# Altium schematic sheet Motor-Y.SchDoc: Motor-Y
size Letter; DocumentNumber: 3; SheetNumber: 6; SheetTotal: 11
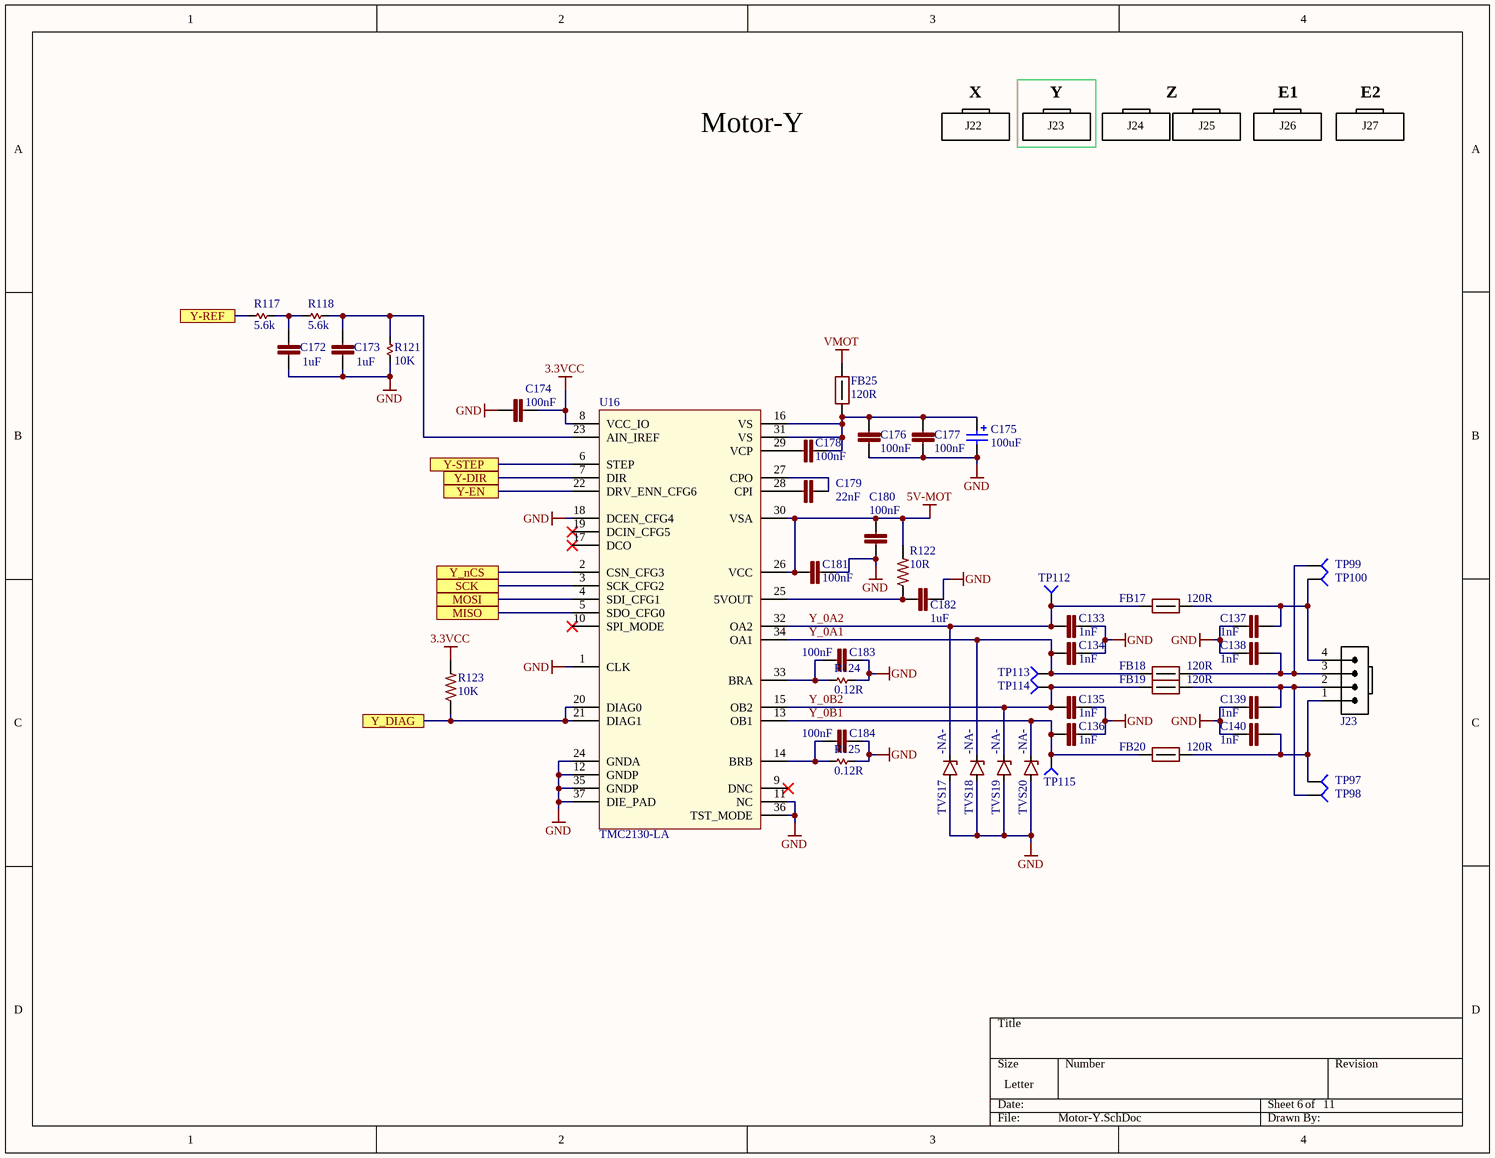
[diagram p0: Motor-Y.SchDoc]

## Parts
C133  1nF  [C0402]
C134  1nF  [C0402]
C135  1nF  [C0402]
C136  1nF  [C0402]
C137  1nF  [C0402]
C138  1nF  [C0402]
C139  1nF  [C0402]
C140  1nF  [C0402]
C172  1uF  [C0402]
C173  1uF  [C0402]
C174  100nF  [C0402]
C175  value 100uF  [CAP-ELEC-063063077]  (hidden comment: UWT1V101MCL1GS)
C176  100nF  [C0603]
C177  100nF  [C0603]
C178  100nF  [C0603]
C179  22nF  [C0402]
C180  100nF  [C0402]
C181  100nF  [C0402]
C182  1uF  [C0402]
C183  100nF  [C0603]
C184  100nF  [C0603]
FB17  120R  [FB0603]
FB18  120R  [FB0603]
FB19  120R  [FB0603]
FB20  120R  [FB0603]
FB25  120R  [FB0603]
J23  Molex 0705430038  [4POL254 PIN-IN-PASTE]  (value not drawn)
R117  5.6k  [R0402]
R118  5.6k  [R0402]
R121  10K  [R0402]
R122  10R  [R0402]
R123  10K  [R0402]
R124  0.12R  [R1206]
R125  0.12R  [R1206]
TP97  TP4  [TP-2]  (value not drawn)  (no BOM)
TP98  TP4  [TP-2]  (value not drawn)  (no BOM)
TP99  TP4  [TP-2]  (value not drawn)  (no BOM)
TP100  TP4  [TP-2]  (value not drawn)  (no BOM)
TP112  TP4  [TP-2]  (value not drawn)  (no BOM)
TP113  TP4  [TP-2]  (value not drawn)  (no BOM)
TP114  TP4  [TP-2]  (value not drawn)  (no BOM)
TP115  TP4  [TP-2]  (value not drawn)  (no BOM)
TVS17  value -NA-  [SMF]  (hidden comment: TVS 30V SMF)
TVS18  value -NA-  [SMF]  (hidden comment: TVS 30V SMF)
TVS19  value -NA-  [SMF]  (hidden comment: TVS 30V SMF)
TVS20  value -NA-  [SMF]  (hidden comment: TVS 30V SMF)
U16  TMC2130-LA  [QFN36-50P500X600X900_HS-37N]

## Ports
MISO, MOSI, SCK, Y-DIR, Y-EN, Y-REF, Y-STEP, Y_DIAG, Y_nCS

## Nets
3.3VCC: C174.1 R123.2 U16.8(VCC_IO)
5V-MOT: C180.2 C181.2 R122.2 U16.26(VCC) U16.30(VSA)
GND: C133.2 C134.2 C135.2 C136.2 C137.2 C138.2 C139.2 C140.2 C172.2 C173.2 C174.2 C175.2 C176.1 C177.1 C180.1 C181.1 C182.2 C183.1 C184.1 R121.1 R124.2 R125.2 TVS17.A TVS18.A TVS19.A TVS20.A U16.1(CLK) U16.11(NC) U16.12(GNDP) U16.18(DCEN_CFG4) U16.24(GNDA) U16.35(GNDP) U16.36(TST_MODE) U16.37(DIE_PAD)
VMOT: FB25.2
MISO: U16.5(SDO_CFG0) ; port MISO
MOSI: U16.4(SDI_CFG1) ; port MOSI
SCK: U16.3(SCK_CFG2) ; port SCK
Y-DIR: U16.7(DIR) ; port Y-DIR
Y-EN: U16.22(DRV_ENN_CFG6) ; port Y-EN
Y-REF: R117.1 ; port Y-REF
Y-STEP: U16.6(STEP) ; port Y-STEP
Y_0A1: C134.1 FB18.1 TP113.1 TVS18.K U16.34(OA1)
Y_0A2: C133.1 FB17.1 TP112.1 TVS17.K U16.32(OA2)
Y_0B1: C136.1 FB20.1 TP115.1 TVS20.K U16.13(OB1)
Y_0B2: C135.1 FB19.1 TP114.1 TVS19.K U16.15(OB2)
Y_DIAG: R123.1 U16.20(DIAG0) U16.21(DIAG1) ; port Y_DIAG
Y_nCS: U16.2(CSN_CFG3) ; port Y_nCS
NetC137_1: C137.1 FB17.2 J23.4 TP100.1
NetC138_1: C138.1 FB18.2 J23.3 TP99.1
NetC139_1: C139.1 FB19.2 J23.2 TP98.1
NetC140_1: C140.1 FB20.2 J23.1 TP97.1
NetC172_1: C172.1 R117.2 R118.1
NetC173_1: C173.1 R118.2 R121.2 U16.23(AIN_IREF)
NetC175_1: C175.1 C176.2 C177.2 C178.2 FB25.1 U16.16(VS) U16.31(VS)
NetC178_1: C178.1 U16.29(VCP)
NetC179_1: C179.1 U16.28(CPI)
NetC179_2: C179.2 U16.27(CPO)
NetC182_1: C182.1 R122.1 U16.25(5VOUT)
NetC183_2: C183.2 R124.1 U16.33(BRA)
NetC184_2: C184.2 R125.1 U16.14(BRB)

Not connected (* = marked no-connect by the designer): U16 9(DNC)* 10(SPI_MODE)* 17(DCO)* 19(DCIN_CFG5)*

## Notes on the sheet
- X
- Y
- Z
- E1
- E2
- Motor-Y
- J22
- J23
- J24
- J25
- J26
- J27

## Library data of the parts
C133-C140 = CAP 1nF 50V 0402 X7R: 1000pF 50V Ceramic Capacitor X7R 0402 (1005 Metric) 0.039" L x 0.020" W (1.00mm x 0.50mm); MANUFACTURER: Murata; MANUFACTURER #: GRM155R71H102KA01D; PART: 1nF 50V X7R 0402; PART DESCRIPTION: 1000pF ±10% 50V Ceramic Capacitor X7R 0402 (1005 Metric); TOLERANCE: 10%; VALUE: 1nF; DISTRIBUTOR #: 490-1303-2-ND; DISTRIBUTOR: Digi-Key Electronics; EE_SPEC: 50V
C172 C173 = GRM155R60J105KE19D: CAP CER 0402 1uF 6.3V 10% X5R; MANUFACTURER: Murata; PART: 1uF 6.3V X5R 0402; PART DESCRIPTION: 1µF ±10% 6.3V Ceramic Capacitor X5R 0402 (1005 Metric); VALUE: 1uF; MANUFACTURER #: GRM155R60J105KE19D; DISTRIBUTOR #: 490-1320-2-ND; DISTRIBUTOR: Digi-Key Electronics; TOLERANCE: 10%; EE_SPEC: 1uF 6.3V X5R 0402
C174 C180 C181 = GRM155R71C104KA88D: CAP CER 0402 100nF 16V 10% X7R; Manufacturer: Murata; PART: 0.1uF 16V X7R 0402; Part Description: 0.10µF ±10% 16V Ceramic Capacitor X7R 0402 (1005 Metric); EE_SPEC: 100nF 16V X7R 0402; VALUE: 100nF; MANUFACTURER #: GRM155R71C104KA88D; DISTRIBUTOR #: 490-3261-2-ND; DISTRIBUTOR: Digi-Key Electronics; Tolerance: 10%
C175 = UWT1V101MCL1GS: CAP ALUM 100UF 35V 20% SMD; Manufacturer: Nichicon; PART: 100uF 35V SMD Al-El; Part Description: 100µF 35V Aluminum Capacitors Radial, Can - SMD 1000 Hrs @ 105°C; EE_SPEC: 100uF 35V Al-El; MANUFACTURER #: UWT1V101MCL1GS; DISTRIBUTOR #: 493-2203-2-ND; DISTRIBUTOR: Digi-Key Electronics; Tolerance: 20%
C176-C178 C183 C184 = C0603C104K5RACTU: CAP CER 0603 100nF 50V 10% X7R; Manufacturer: Kemet; Part Description: 0.1µF ±10% 50V Ceramic Capacitor X7R 0603 (1608 Metric); EE_SPEC: 100nF 50V X7R 0603; VALUE: 100nF; MANUFACTURER #: C0603C104K5RACTU; DISTRIBUTOR #: 399-5089-2-ND; DISTRIBUTOR: Digi-Key Electronics; PART: 100nF 50V X7R 0603; Tolerance: 10%
C179 = GCM155R71H223KA55D: CAP CER 0402 22nF ±10% 50V X7R; Manufacturer: YAGEO; Part Description: 0.022µF ±10% 50V Ceramic Capacitor X7R 0402 (1005 Metric); EE_SPEC: 22nF 50V X7R 0402; Tolerance: +/- 10%; VALUE: 22nF; MANUFACTURER #: GCM155R71H223KA55D; DISTRIBUTOR #: 490-4763-2-ND; DISTRIBUTOR: Digi-Key Electronics; PART: 22nF
C182 = GRM155R60J105KE19D: CAP CER 0402 1uF 6.3V 10% X5R; Manufacturer: Murata; Part Description: 1µF ±10% 6.3V Ceramic Capacitor X5R 0402 (1005 Metric); EE_SPEC: 1uF 6.3V X5R 0402; VALUE: 1uF; MANUFACTURER #: GRM155R60J105KE19D; DISTRIBUTOR #: 490-1320-2-ND; DISTRIBUTOR: Digi-Key Electronics; PART: 1uF 6.3V X5R 0402; Tolerance: 10%
FB17-FB20 = FERRITE 120R 3A 0603: FERRITE BEAD 120 OHM 0603 1LN; MANUFACTURER: Samsung; MANUFACTURER #: CIS10P121AC; MANUFACTURER2#: 490-5254-2-ND; VALUE: 120Rfb; TOLERANCE: -NA-; EE_SPEC: 3A; DISTRIBUTOR #: 1276-6351-2-ND; DISTRIBUTOR: Digi-Key Electronics; PART: FERRITE 120R 3A 0603; PART DESCRIPTION: FERRITE BEAD 120 OHM 0603 1LN
FB25 = FERRITE 120R 3A 0603: FERRITE BEAD 120 OHM 0603 1LN; MANUFACTURER: Samsung; MANUFACTURER #: CIS10P121AC; VALUE: 120Rfb; TOLERANCE: -NA-; EE_SPEC: 3A; DISTRIBUTOR #: 1276-6351-2-ND; DISTRIBUTOR: Digi-Key Electronics; PART: FERRITE 120R 3A 0603; PART DESCRIPTION: FERRITE BEAD 120 OHM 0603 1LN
J23 = Molex 0705430003 PIP: Molex 4 Pin Clip Connector - Pin In Paste footprint
R117 R118 = 5.6k 1% 0402: RES SMD 5.6K OHM 1% 1/16W 0402; MANUFACTURER: YAGEO; MANUFACTURER #: RC0402FR-075K6L; PART DESCRIPTION: ±1% 0.063W, 1/16W Chip Resistor 0402 (1005 Metric) Moisture Resistant Thick Film; DISTRIBUTOR #: 311-5.6KLRTR-ND; DISTRIBUTOR: Digi-Key Electronics; PART: RES SMD 5.6K OHM 1% 1/16W 0402; TOLERANCE: 1%; EE_SPEC: 1/16W; VALUE: 5.6k
R121 = 10k 1% 0402: RES SMD 10K OHM 1% 1/16W 0402; MANUFACTURER: Yageo; MANUFACTURER #: RC0402FR-0710KP; PART DESCRIPTION: 10k Ohm ±1% 0.063W, 1/16W Chip Resistor 0402 (1005 Metric) Moisture Resistant Thick Film; DISTRIBUTOR #: YAG1249TR-ND; DISTRIBUTOR: Digi-Key Electronics; PART: 10k 1% 0402; TOLERANCE: 1%; EE_SPEC: 1/16W; VALUE: 10K
R122 = RC0402FR-0710RL: RES SMD 10 OHM 1% 1/16W 0402; Manufacturer: Yageo; Part Description: 10 Ohm ±1% 0.063W, 1/16W Chip Resistor 0402 (1005 Metric) Moisture Resistant Thick Film; EE_SPEC: 10R 1% 0402; VALUE: 10R; MANUFACTURER #: RC0402FR-0710RL; DISTRIBUTOR #: 311-10.0LRTR-ND; DISTRIBUTOR: Digi-Key Electronics; PART: 10R; Tolerance: 1%
R123 = RC0402FR-0710KP: RES SMD 10K OHM 1% 1/16W 0402; MANUFACTURER: Yageo; PART: 10k 1% 0402; PART DESCRIPTION: 10k Ohm ±1% 0.063W, 1/16W Chip Resistor 0402 (1005 Metric) Moisture Resistant Thick Film; VALUE: 10K; MANUFACTURER #: RC0402FR-0710KP; DISTRIBUTOR #: YAG1249TR-ND; DISTRIBUTOR: Digi-Key Electronics; TOLERANCE: 1%; EE_SPEC: 1/16W
R124 R125 = 0.12R 1% 1206: RES 0.12 OHM 1% 1/2W 1206; MANUFACTURER #: RL1206FR-7W0R12L; Part Description: 120 mOhms ±1% 0.5W, 1/2W Chip Resistor 1206 (3216 Metric) Automotive AEC-Q200, Current Sense, Moisture Resistant Thick Film; Tolerance: +/- 1%; DISTRIBUTOR #: 311-.12LYTR-ND; DISTRIBUTOR: Digi-Key; EE_SPEC: 0.12R 1% 1206; PART: 0.12R; VALUE: 0.12R
TP97-TP100 TP112-TP115 = Socket: MANUFACTURER #: NOTAPART-Testpoint
TVS17-TVS20 = TVS 30V SMF: TVS DIODE 30VWM 48.4VC SMF; MANUFACTURER: Vishay; MANUFACTURER #: SMF30A-E3-08; PART: TVS Diode 48.4VC; EE_SPEC: 30Vrs 48.4Vc; DISTRIBUTOR #: SMF30A-E3-08GITR-ND; DISTRIBUTOR: Digi-Key Electronics; PART DESCRIPTION: TVS DIODE 30VWM 48.4VC SMF; TOLERANCE: -NA-
U16 = TMC2130-LA-T: IC STEPPER MOTOR DVR SPI 36QFN; Manufacturer: Trinamic; Part Description: Bipolar Motor Driver Power MOSFET SPI, Step/Direction 36-QFN (5x6); EE_SPEC: 46V 1.2A 1/256 Step; Tolerance: NA; DISTRIBUTOR #: 1460-1130-2-ND; DISTRIBUTOR: Digi-Key Electronics; MANUFACTURER #: TMC2130-LA-T; PART: TMC2130; VALUE: TMC2130